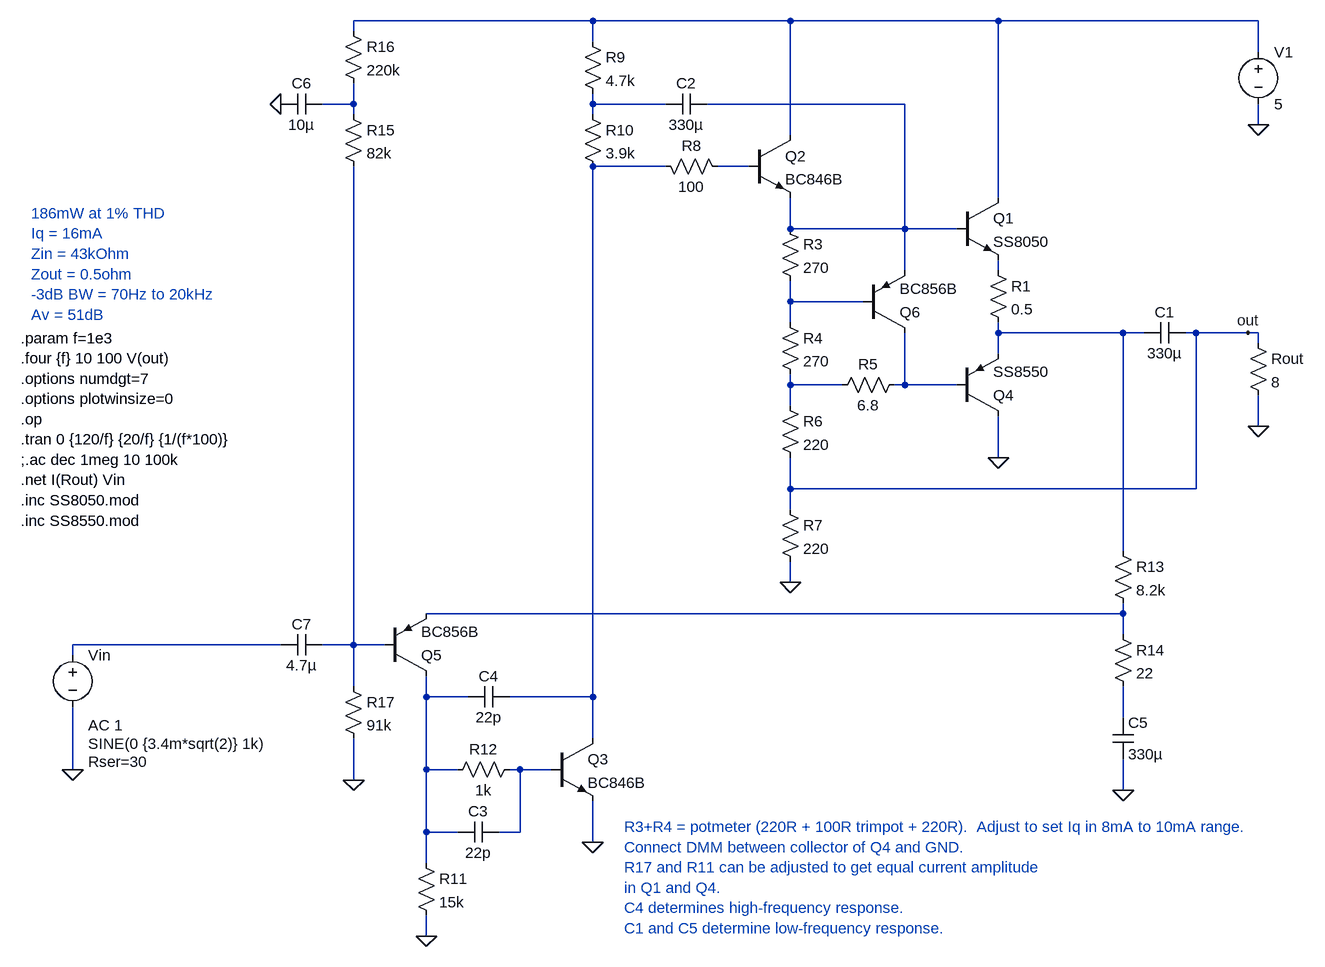
[diagram p0: schematic grundig_city_boy_100_JLCPCB.asc]
grundig_city_boy_100_JLCPCB.asc, the LTspice schematic file:
Version 4
SHEET 1 880 1284
WIRE -384 -256 -752 -256
WIRE -80 -256 -384 -256
WIRE 240 -256 -80 -256
WIRE 640 -256 240 -256
WIRE -752 -240 -752 -256
WIRE -384 -224 -384 -256
WIRE 640 -208 640 -256
WIRE -752 -128 -752 -160
WIRE -752 -128 -800 -128
WIRE -384 -128 -384 -144
WIRE -272 -128 -384 -128
WIRE 96 -128 -208 -128
WIRE -752 -112 -752 -128
WIRE -384 -112 -384 -128
WIRE 640 -96 640 -128
WIRE -80 -80 -80 -256
WIRE -272 -32 -384 -32
WIRE -144 -32 -192 -32
WIRE 240 16 240 -256
WIRE -80 64 -80 16
WIRE 96 64 96 -128
WIRE 96 64 -80 64
WIRE 176 64 96 64
WIRE 96 128 96 64
WIRE 240 128 240 112
WIRE -80 176 -80 144
WIRE 32 176 -80 176
WIRE -80 208 -80 176
WIRE 240 224 240 208
WIRE 432 224 240 224
WIRE 464 224 432 224
WIRE 544 224 528 224
WIRE 624 224 544 224
WIRE 640 224 624 224
WIRE 640 240 640 224
WIRE 240 256 240 224
WIRE -80 304 -80 288
WIRE 0 304 -80 304
WIRE 96 304 96 224
WIRE 96 304 80 304
WIRE 176 304 96 304
WIRE -80 336 -80 304
WIRE 640 368 640 320
WIRE 240 416 240 352
WIRE -80 464 -80 416
WIRE 544 464 544 224
WIRE 544 464 -80 464
WIRE -80 496 -80 464
WIRE 432 560 432 224
WIRE -80 608 -80 576
WIRE 432 656 432 640
WIRE 432 656 -640 656
WIRE 432 688 432 656
WIRE -864 704 -1184 704
WIRE -752 704 -752 -32
WIRE -752 704 -800 704
WIRE -704 704 -752 704
WIRE -1184 720 -1184 704
WIRE -752 768 -752 704
WIRE -640 784 -640 752
WIRE -576 784 -640 784
WIRE -384 784 -384 -32
WIRE -384 784 -512 784
WIRE 432 816 432 768
WIRE -384 848 -384 784
WIRE -1184 896 -1184 800
WIRE -640 896 -640 784
WIRE -592 896 -640 896
WIRE -496 896 -512 896
WIRE -448 896 -496 896
WIRE -752 912 -752 848
WIRE 432 928 432 880
WIRE -640 992 -640 896
WIRE -592 992 -640 992
WIRE -496 992 -496 896
WIRE -496 992 -528 992
WIRE -384 1008 -384 944
WIRE -640 1040 -640 992
WIRE -640 1152 -640 1120
FLAG 240 416 0
FLAG 640 368 0
FLAG 640 -96 0
FLAG -80 608 0
FLAG -384 1008 0
FLAG -640 1152 0
FLAG 432 928 0
FLAG -752 912 0
FLAG -864 -128 0
FLAG -1184 896 0
FLAG 624 224 out
DATAFLAG 352 224 ""
SYMBOL npn 176 16 R0
SYMATTR InstName Q1
SYMATTR Value SS8050
SYMBOL npn -144 -80 R0
SYMATTR InstName Q2
SYMATTR Value BC846B
SYMBOL pnp 176 352 M180
SYMATTR InstName Q4
SYMATTR Value SS8550
SYMBOL res 224 112 R0
SYMATTR InstName R1
SYMATTR Value 0.5
SYMBOL cap 528 208 R90
WINDOW 0 0 32 VBottom 2
WINDOW 3 32 32 VTop 2
SYMATTR InstName C1
SYMATTR Value 330µ
SYMBOL res 624 224 R0
SYMATTR InstName Rout
SYMATTR Value 8
SYMBOL voltage 640 -224 R0
SYMATTR InstName V1
SYMATTR Value 5
SYMBOL pnp 32 224 M180
SYMATTR InstName Q6
SYMATTR Value BC856B
SYMBOL res -96 48 R0
SYMATTR InstName R3
SYMATTR Value 270
SYMBOL res -96 192 R0
SYMATTR InstName R4
SYMATTR Value 270
SYMBOL res 96 288 R90
WINDOW 0 0 56 VBottom 2
WINDOW 3 32 56 VTop 2
SYMATTR InstName R5
SYMATTR Value 6.8
SYMBOL res -96 320 R0
SYMATTR InstName R6
SYMATTR Value 220
SYMBOL res -96 480 R0
SYMATTR InstName R7
SYMATTR Value 220
SYMBOL res -288 -48 M90
WINDOW 0 0 56 VBottom 2
WINDOW 3 32 56 VTop 2
SYMATTR InstName R8
SYMATTR Value 100
SYMBOL cap -208 -144 R90
WINDOW 0 0 32 VBottom 2
WINDOW 3 32 32 VTop 2
SYMATTR InstName C2
SYMATTR Value 330µ
SYMBOL res -400 -240 R0
SYMATTR InstName R9
SYMATTR Value 4.7k
SYMBOL res -400 -128 R0
SYMATTR InstName R10
SYMATTR Value 3.9k
SYMBOL npn -448 848 R0
SYMATTR InstName Q3
SYMATTR Value BC846B
SYMBOL res -656 1024 R0
SYMATTR InstName R11
SYMATTR Value 15k
SYMBOL res -496 880 R90
WINDOW 0 0 56 VBottom 2
WINDOW 3 32 56 VTop 2
SYMATTR InstName R12
SYMATTR Value 1k
SYMBOL cap -528 976 R90
WINDOW 0 0 32 VBottom 2
WINDOW 3 32 32 VTop 2
SYMATTR InstName C3
SYMATTR Value 22p
SYMBOL cap -512 768 R90
WINDOW 0 0 32 VBottom 2
WINDOW 3 32 32 VTop 2
SYMATTR InstName C4
SYMATTR Value 22p
SYMBOL res 416 544 R0
SYMATTR InstName R13
SYMATTR Value 8.2k
SYMBOL res 416 672 R0
SYMATTR InstName R14
SYMATTR Value 22
SYMBOL cap 416 816 R0
SYMATTR InstName C5
SYMATTR Value 330µ
SYMBOL pnp -704 752 M180
SYMATTR InstName Q5
SYMATTR Value BC856B
SYMBOL res -768 -128 R0
SYMATTR InstName R15
SYMATTR Value 82k
SYMBOL res -768 -256 R0
SYMATTR InstName R16
SYMATTR Value 220k
SYMBOL cap -800 -144 R90
WINDOW 0 0 32 VBottom 2
WINDOW 3 32 32 VTop 2
SYMATTR InstName C6
SYMATTR Value 10µ
SYMBOL res -768 752 R0
SYMATTR InstName R17
SYMATTR Value 91k
SYMBOL cap -800 688 R90
WINDOW 0 0 32 VBottom 2
WINDOW 3 32 32 VTop 2
SYMATTR InstName C7
SYMATTR Value 4.7µ
SYMBOL voltage -1184 704 R0
WINDOW 3 24 152 Left 2
WINDOW 123 24 124 Left 2
WINDOW 39 24 180 Left 2
SYMATTR Value SINE(0 {3.4m*sqrt(2)} 1k)
SYMATTR Value2 AC 1
SYMATTR SpiceLine Rser=30
SYMATTR InstName Vin
TEXT -1264 232 Left 2 !.param f=1e3\n.four {f} 10 100 V(out)\n.options numdgt=7\n.options plotwinsize=0\n.op\n.tran 0 {120/f} {20/f} {1/(f*100)}\n;.ac dec 1meg 10 100k\n.net I(Rout) Vin\n.inc SS8050.mod\n.inc SS8550.mod
TEXT -1248 40 Left 2 ;186mW at 1% THD\nIq = 16mA\nZin = 43kOhm\nZout = 0.5ohm\n-3dB BW = 70Hz to 20kHz\nAv = 51dB
TEXT -336 984 Left 2 ;R3+R4 = potmeter (220R + 100R trimpot + 220R).  Adjust to set Iq in 8mA to 10mA range.  \nConnect DMM between collector of Q4 and GND.\nR17 and R11 can be adjusted to get equal current amplitude \nin Q1 and Q4.\nC4 determines high-frequency response.\nC1 and C5 determine low-frequency response.

The netlist it stands for:
* grundig_city_boy_100_JLCPCB.asc
Q1 N001 N004 N007 0 SS8050
Q2 N001 N006 N004 0 BC846B
Q4 0 N011 N009 0 SS8550
R1 N007 N009 0.5
C1 out N009 330µ
Rout out 0 8
V1 N001 0 5
Q6 N011 N008 N004 0 BC856B
R3 N004 N008 270
R4 N008 N010 270
R5 N011 N010 6.8
R6 N010 out 220
R7 out 0 220
R8 N005 N006 100
C2 N004 N003 330µ
R9 N001 N003 4.7k
R10 N003 N005 3.9k
Q3 N005 N017 0 0 BC846B
R11 N015 0 15k
R12 N017 N015 1k
C3 N017 N015 22p
C4 N005 N015 22p
R13 N009 N012 8.2k
R14 N012 N016 22
C5 N016 0 330µ
Q5 N015 N014 N012 0 BC856B
R15 N002 N014 82k
R16 N001 N002 220k
C6 N002 0 10µ
R17 N014 0 91k
C7 N014 N013 4.7µ
Vin N013 0 SINE(0 {3.4m*sqrt(2)} 1k) AC 1 Rser=30
.model NPN NPN
.model PNP PNP
.lib standard.bjt
.param f=1e3
.four {f} 10 100 V(out)
.options numdgt=7
.options plotwinsize=0
.op
.tran 0 {120/f} {20/f} {1/(f*100)}
;.ac dec 1meg 10 100k
.net I(Rout) Vin
.inc SS8050.mod
.inc SS8550.mod
* 186mW at 1% THD
* Iq = 16mA
* Zin = 43kOhm
* Zout = 0.5ohm
* -3dB BW = 70Hz to 20kHz
* Av = 51dB
* R3+R4 = potmeter (220R + 100R trimpot + 220R).  Adjust to set Iq in 8mA to 10mA range.
* Connect DMM between collector of Q4 and GND.
* R17 and R11 can be adjusted to get equal current amplitude
* in Q1 and Q4.
* C4 determines high-frequency response.
* C1 and C5 determine low-frequency response.
.backanno
.end